# EAGLE schematic snullv7 (EAGLE 7.2.0)
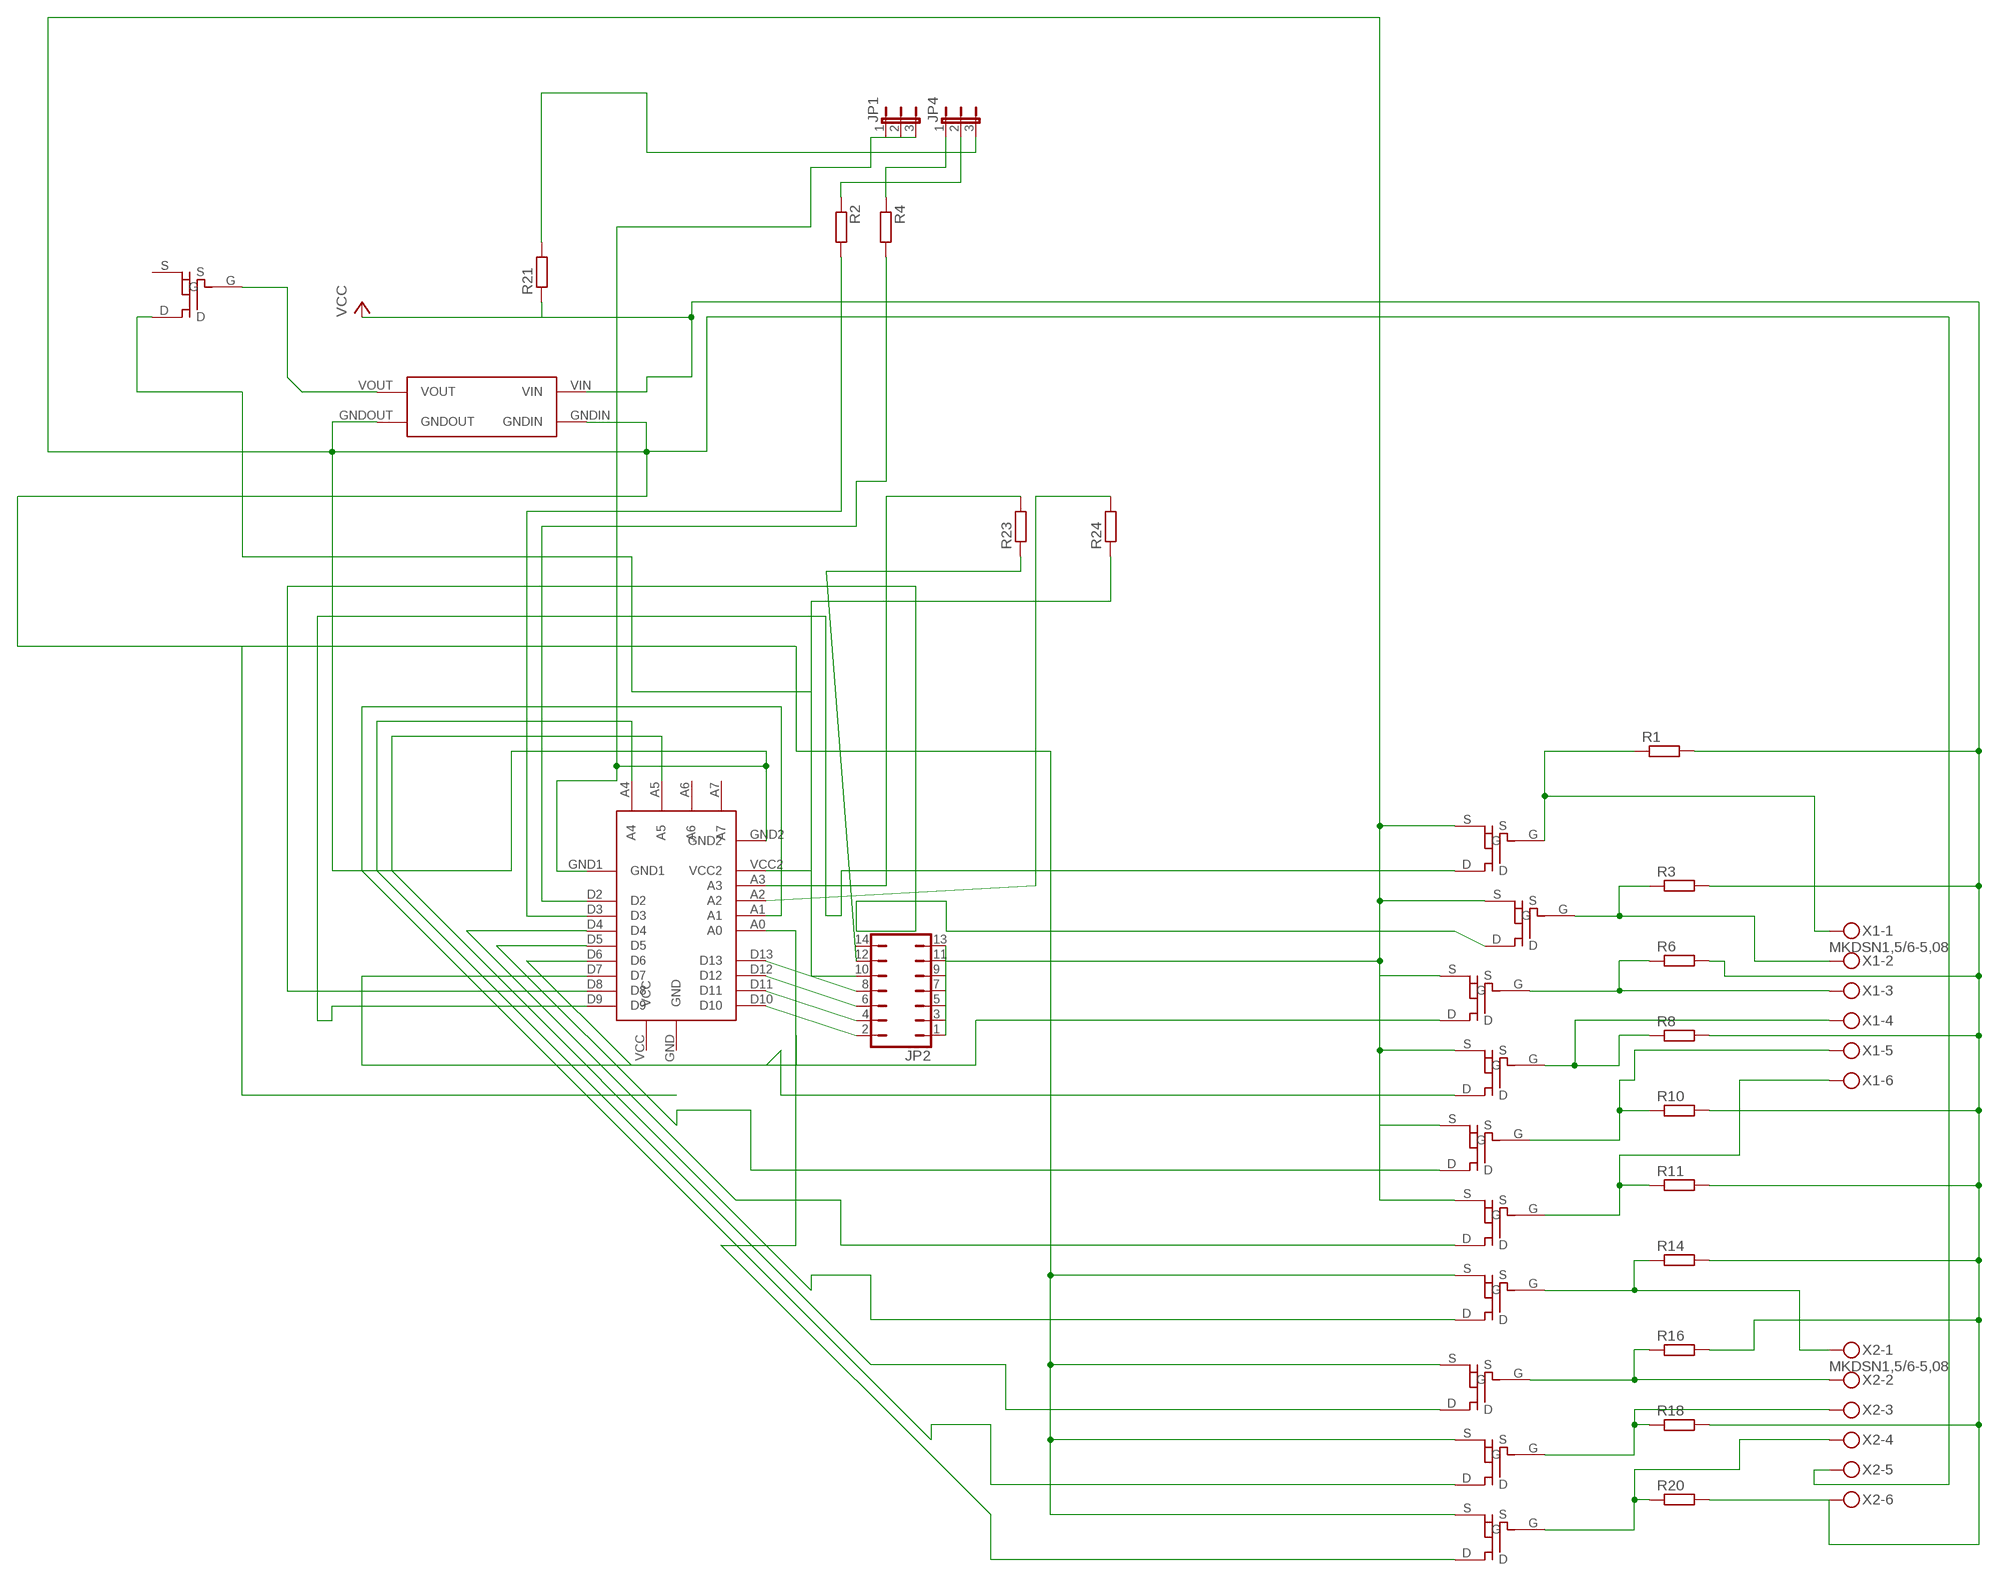
[diagram p0: schematic, sheet 1]

## Parts
JP1  JP2E  [JP2]
JP2  JP7Q  [JP7Q]
JP4  JP2E  [JP2]
R1  R-EU_R0805  [R0805]
R2  R-EU_R0805  [R0805]
R3  R-EU_R0805  [R0805]
R4  R-EU_R0805  [R0805]
R6  R-EU_R0805  [R0805]
R8  R-EU_R0805  [R0805]
R10  R-EU_R0805  [R0805]
R11  R-EU_R0805  [R0805]
R14  R-EU_R0805  [R0805]
R16  R-EU_R0805  [R0805]
R18  R-EU_R0805  [R0805]
R20  R-EU_R0805  [R0805]
R21  R-EU_R0805  [R0805]
R23  R-EU_R0805  [R0805]
R24  R-EU_R0805  [R0805]
U$1  ARDUINOPROMINIREDUCED  [ARDUINOPROMINIREDUCED]
U$2  VREGMODULE  [VREGMODULE]
U$3  MOSFET-TO236  [MOSFET-TO236]
U$4  MOSFET-TO236  [MOSFET-TO236]
U$5  MOSFET-TO236  [MOSFET-TO236]
U$6  MOSFET-TO236  [MOSFET-TO236]
U$7  MOSFET-TO236  [MOSFET-TO236]
U$8  MOSFET-TO236  [MOSFET-TO236]
U$9  MOSFET-TO236  [MOSFET-TO236]
U$10  MOSFET-TO236  [MOSFET-TO236]
U$11  MOSFET-TO236  [MOSFET-TO236]
U$12  MOSFET-TO236  [MOSFET-TO236]
U$13  MOSFET-TO236  [MOSFET-TO236]
X1  MKDSN1,5/6-5,08  [MKDSN1,5/6-5,08]
X2  MKDSN1,5/6-5,08  [MKDSN1,5/6-5,08]

## Nets
GND: JP1.1 JP1.2 JP1.3 JP2.1 JP2.3 JP2.5 JP2.7 JP2.9 JP2.11 JP2.13 U$1.GND1 U$1.GND2 U$2.GNDIN U$2.GNDOUT U$3.S U$4.S U$5.S U$6.S U$7.S U$8.S U$9.S U$10.S U$11.S U$12.S X2.5
N$1: R14.1 U$9.G X2.1
N$2: R10.1 U$7.G X1.5
N$3: JP2.2 U$1.D10
N$4: R16.1 U$10.G X2.2
N$5: R18.1 U$11.G X2.3
N$6: JP2.4 U$1.D11
N$7: JP2.6 U$1.D12
N$8: U$1.D8 U$4.D
N$9: JP2.8 U$1.D13
N$10: U$1.D9 U$3.D
N$12: U$1.VCC2 U$13.D
N$13: U$1.A5 U$9.D
N$14: U$1.D6 U$6.D
N$15: U$1.D5 U$7.D
N$16: U$1.A4 U$10.D
N$17: U$1.D4 U$8.D
N$18: U$1.D7 U$5.D
N$19: U$2.VOUT U$13.G
N$20: JP2.10 R24.1
N$21: U$1.A0 U$12.D
N$22: R1.1 U$3.G X1.1
N$23: R3.1 U$4.G X1.2
N$24: U$1.A1 U$11.D
N$25: R6.1 U$5.G X1.3
N$27: R8.1 U$6.G X1.4
N$28: R11.1 U$8.G X1.6
N$29: JP4.3 R21.2
N$30: R20.1 U$12.G X2.4
N$33: JP4.1 R4.1
N$34: JP4.2 R2.1
N$35: R2.2 U$1.D3
N$36: JP2.12 R23.1
N$37: R4.2 U$1.D2
N$38: R23.2 U$1.A3
N$39: R24.2 U$1.A2
VCC: R1.2 R3.2 R6.2 R8.2 R10.2 R11.2 R14.2 R16.2 R18.2 R20.2 R21.1 U$2.VIN X2.6
Unconnected: JP2.14 U$1.A6 U$1.A7 U$1.GND U$1.VCC U$13.S

## Library data of the parts
JP1 JP4 = jumper:JP2E: JUMPER
JP2 = jumper:JP7Q: JUMPER
R1-R4 R6 R8 R10 R11 R14 R16 R18 R20 R21 R23 R24 = resistor:R-EU_: RESISTOR, European symbol
U$1 = snulllib:ARDUINOPROMINIREDUCED
U$2 = snulllib:VREGMODULE
U$3-U$13 = snulllib:MOSFET-TO236
X1 X2 = con-phoenix-508:MKDSN1,5/6-5,08: MKDSN 1,5/ 6-5,08 Printklemme Nennstrom: 13,5 A Nennspannung: 250 V Rastermaß: 5,08 mm Polzahl: 6 Anschlussart: Schraubanschluss Montage: Löten Anschlussrichtung Leiter/Platine: 0 ° Artikelnummer: 1729160 Source: http://eshop.phoenixcontact.com .. 1729160.pdf